# Altium schematic sheet driver_isolated_trans.SchDoc
size A
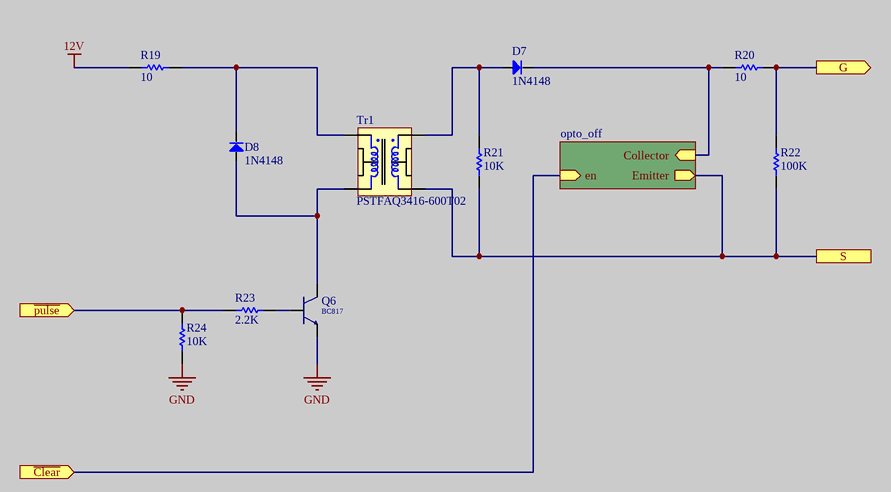
[diagram p0: driver_isolated_trans.SchDoc]

## Parts
D7  1N4148  [FastDiode]
D8  1N4148  [FastDiode]
Q6  NPN transistor  [NPN]  (value not drawn)
R19  10  [RESC0603]
R20  10  [RESC0603]
R21  10K  [RESC0603]
R22  100K  [RESC0603]
R23  2.2K  [RESC0603]
R24  10K  [RESC0603]
Tr1  PSTFAQ3416-600T02  [PSTFAQ3416-600T020]

## Sub-sheets
opto_off = driver_isolated_opto.SchDoc: en (in), Emitter (out), Collector (in)

## Ports
G (out), S, ~{Clear} (in), ~{pulse} (in)

## Nets
12V: R19.2
GND: Q6.2(E) R24.2
~{Clear}: port ~{Clear}, sheet opto_off/en
G: R20.1 R22.2 ; port G
~{pulse}: R23.2 R24.1 ; port ~{pulse}
S: R21.1 R22.1 Tr1.3 ; port S, sheet opto_off/Emitter
NetD7_1: D7.1(A) R21.2 Tr1.4
NetD7_2: D7.2(K) R20.2 ; sheet opto_off/Collector
NetD8_1: D8.1(A) Q6.3(C) Tr1.2
NetD8_2: D8.2(K) R19.1 Tr1.1
NetQ6_1: Q6.1(B) R23.1

## Library data of the parts
D7 D8 = FastDiode: Published: 8-Jun-2000; LatestRevisionDate: 17-Dec-2003; LatestRevisionNote: PCB Footprint replaced.; DatasheetDocument: 16-Apr-2002; PackageDocument: 16-Apr-2002; PackageReference: 3.5X2.8X1.9; Publisher: Altium Limited
Q6 = BC817: 45 V, 0.5 A; Transistor: BC817
R19-R24 = Resistor: 0603,0.1W; Published: 8-Jun-2000; LatestRevisionDate: 17-Jul-2002; LatestRevisionNote: Re-released for DXP Platform.; PackageReference: AXIAL-0.5; Publisher: Altium Limited
  R19 R20: Value: 10
  R21 R24: Value: 10K
  R22: Value: 100K
  R23: Value: 2.2K
Tr1 = transpulse small: MANF: OMRON; MANF_P#: G8QN-1C4 DC12; PARAM2: 16VDC, 30A; PARAM: 12V, 50mA; PRICE: PRICE; Value: PSTFAQ3416-600T02